# Altium schematic sheet V_10.SchDoc
size A4
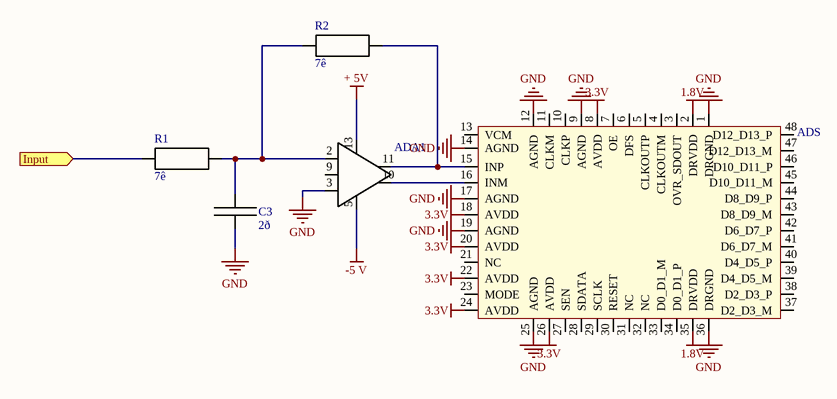
[diagram p0: V_10.SchDoc]

## Parts
(Parts that share a designator on the sheet are numbered #1, #2 ... from top to bottom, then left to right.)
*#1  ADS  [ADS]
*#2  ADA1  [ADA]
C3  2ð  [condenser]
R1  7ê  [resistor]
R2  7ê  [resistor]

## Ports
Input (in)

## Nets
1.8V: *#1.2(DRVDD) *#1.35(DRVDD)
3.3V: *#1.8(AVDD) *#1.18(AVDD) *#1.20(AVDD) *#1.22(AVDD) *#1.24(AVDD) *#1.26(AVDD)
+ 5V: *#2.13
-5 V: *#2.5
GND: *#1.1(DRGND) *#1.9(AGND) *#1.12(AGND) *#1.14(AGND) *#1.17(AGND) *#1.19(AGND) *#1.25(AGND) *#1.36(DRGND) *#2.3 C3.2
Input: R1.2 ; port Input
Net*#1_15: *#1.15(INP) *#2.11 R2.3
Net*#1_16: *#1.16(INM) *#2.10
Net*#2_2: *#2.2 C3.3 R1.3 R2.2

Not connected (* = marked no-connect by the designer): *#1 3(OVR_SDOUT) 4(CLKOUTM) 5(CLKOUTP) 6(DFS) 7(OE) 10(CLKP) 11(CLKM) 13(VCM) 21(NC) 23(MODE) 27(SEN) 28(SDATA) 29(SCLK) 30(RESET) 31(NC) 32(NC) 33(D0_D1_M) 34(D0_D1_P) 37(D2_D3_M) 38(D2_D3_P) 39(D4_D5_M) 40(D4_D5_P) 41(D6_D7_M) 42(D6_D7_P) 43(D8_D9_M) 44(D8_D9_P) 45(D10_D11_M) 46(D10_D11_P) 47(D12_D13_M) 48(D12_D13_P); *#2 9(49)

## Library data of the parts
C3 = condenser
R1 R2 = resistor